# EAGLE design ADIS Arduino Breakout RevA (EAGLE 9.6.2)
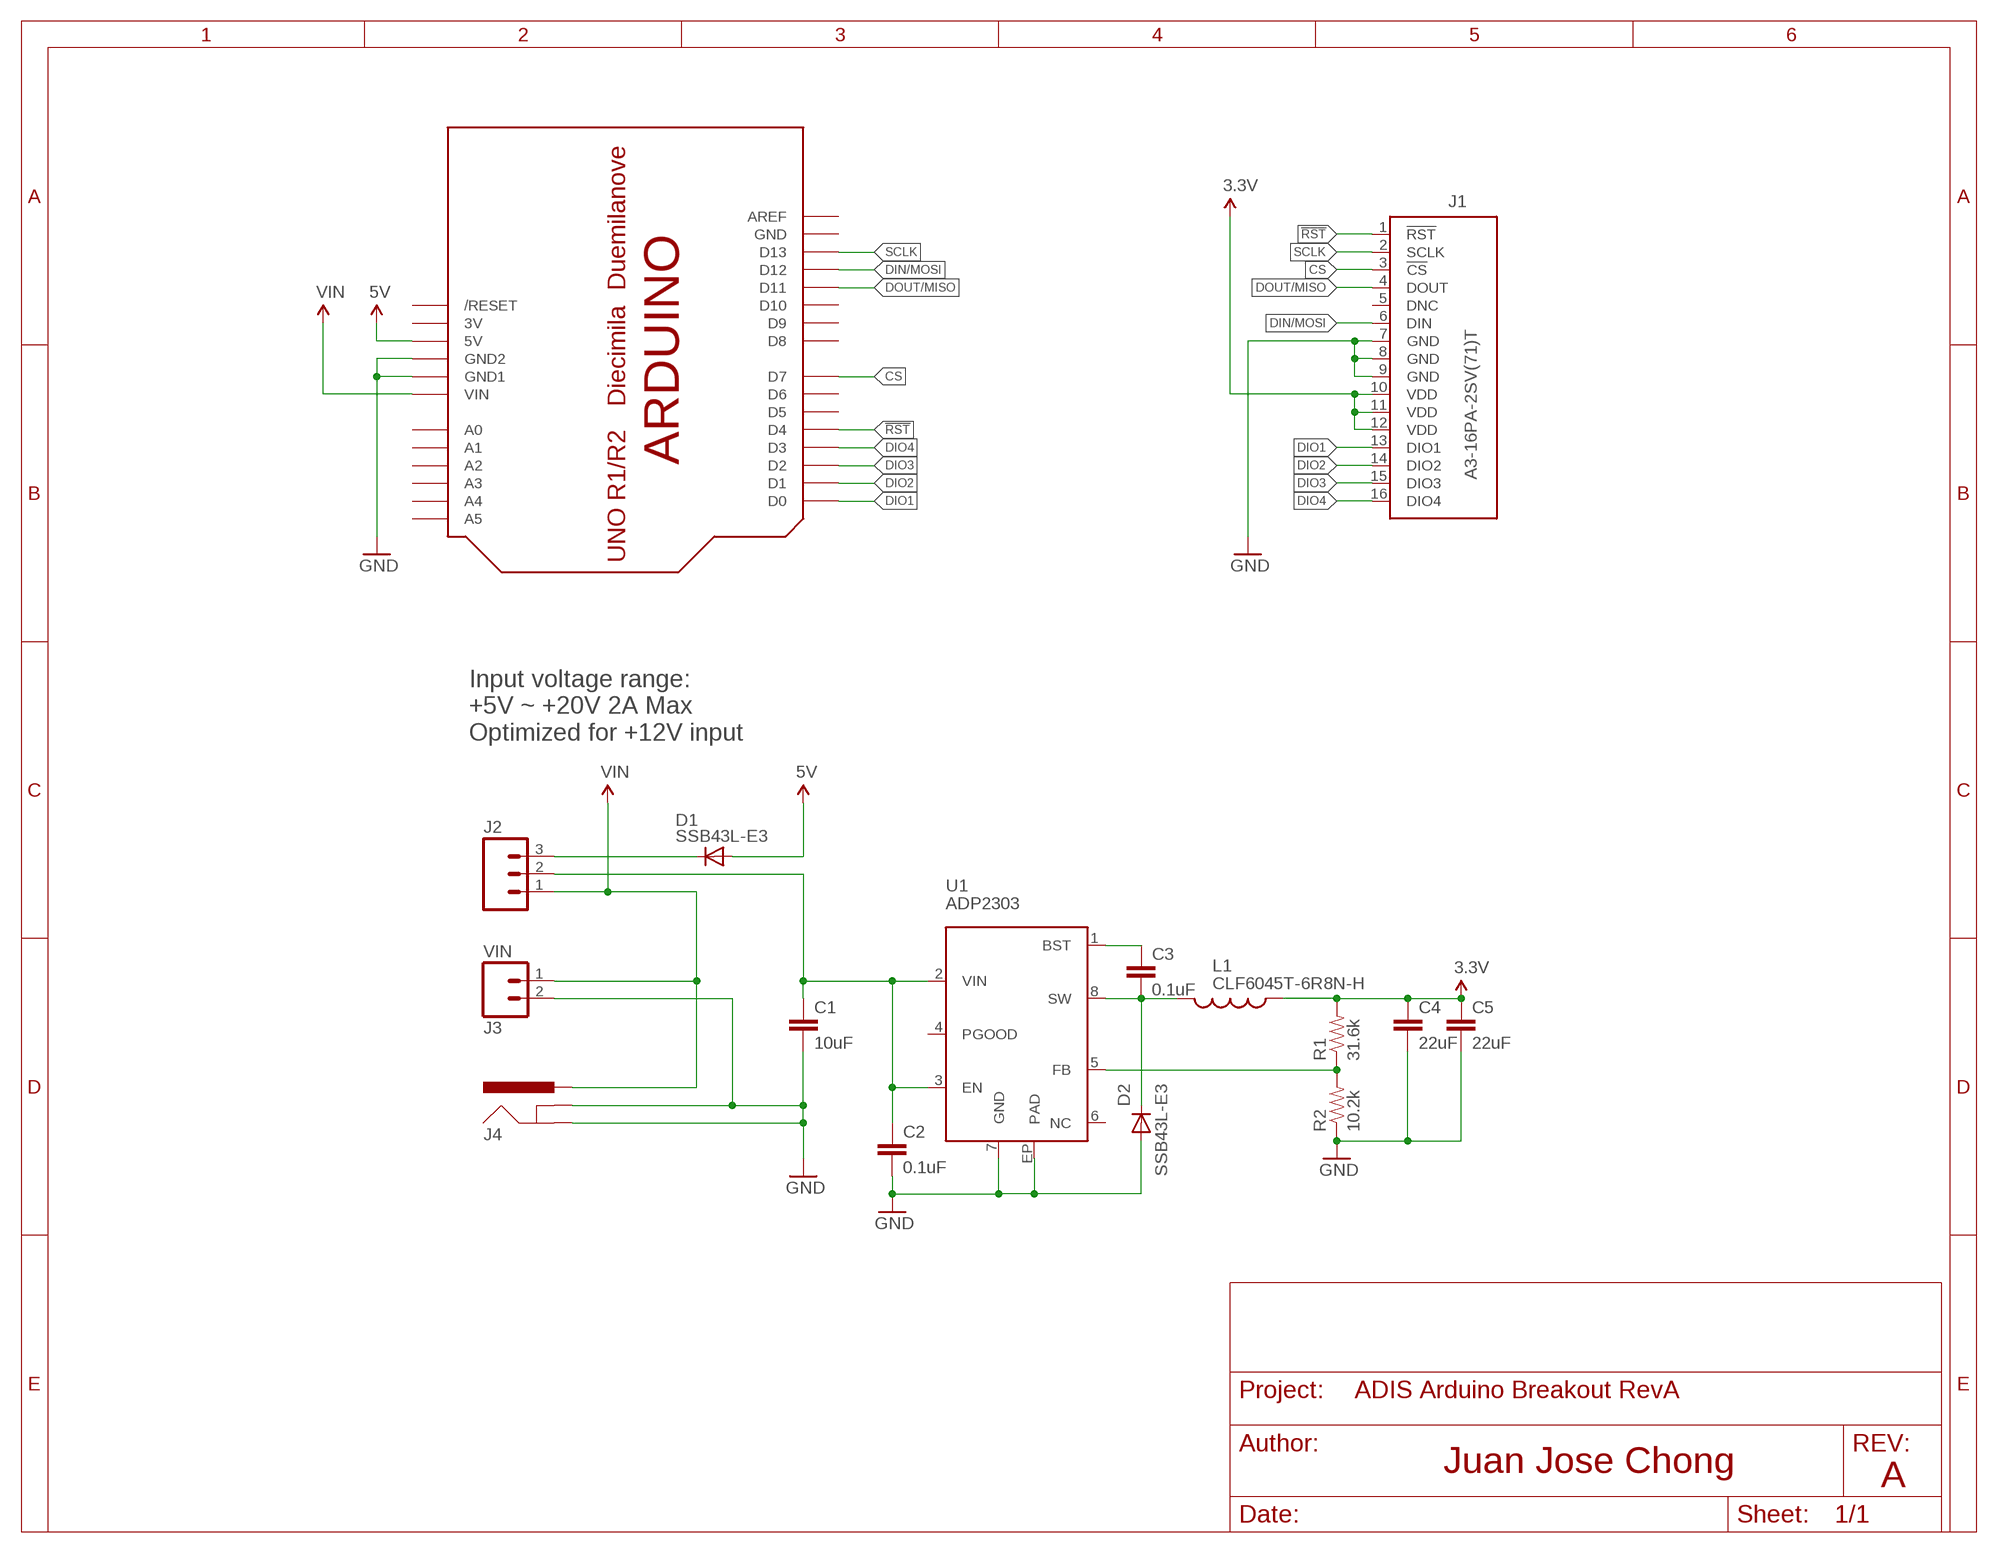
[diagram p0: schematic, sheet 1]

## Parts
C1  10uF  CAP1206  [1206]
C2  0.1uF  CAP0603-CAP  [0603-CAP]
C3  0.1uF  CAP0603-CAP  [0603-CAP]
C4  22uF  CAP1210  [1210]
C5  22uF  CAP1210  [1210]
D1  SSB43L-E3  DIODE-DO214AA  [DO214AA]
D2  SSB43L-E3  DIODE-DO214AA  [DO214AA]
J1  A3-16PA-2SV(71)T  [A3-16PA-2SV(71)-TOP]
J2  M03PTH  [1X03]
J3  VIN  M023.5MM  [SCREWTERMINAL-3.5MM-2]
J4  POWER_JACKPTH_LOCK  [POWER_JACK_PTH_LOCK]
J5  ARDUINOUNO  [ARDUINO]
L1  CLF6045T-6R8N-H  [CLF6045-H]
R1  31.6k  RESISTOR0603-RES  [0603-RES]
R2  10.2k  RESISTOR0603-RES  [0603-RES]
U1  ADP2303  [SOIC-8-PAD]

## Nets
3.3V: C4.1 C5.1 J1.10(VDD) J1.11(VDD) J1.12(VDD) L1.P$1 R1.2
5V: D1.A J5.5V
!RST: J1.1(!RST) J5.D4
CS: J1.3(!CS) J5.D7
DIN/MOSI: J1.6(DIN) J5.D12
DIO1: J1.13(DIO1) J5.D0
DIO2: J1.14(DIO2) J5.D1
DIO3: J1.15(DIO3) J5.D2
DIO4: J1.16(DIO4) J5.D3
DOUT/MISO: J1.4(DOUT) J5.D11
GND: C1.2 C2.2 C4.2 C5.2 D2.A J1.7(GND) J1.8(GND) J1.9(GND) J3.2 J4.GND J4.GNDBREAK J5.GND1 J5.GND2 R2.1 U1.7(GND) U1.EP(PAD)
N$2: R1.1 R2.2 U1.5(FB)
N$3: C3.2 D2.C L1.P$2 U1.8(SW)
N$4: C3.1 U1.1(BST)
N$6: C1.1 C2.1 J2.2 U1.2(VIN) U1.3(EN)
N$7: D1.C J2.3
SCLK: J1.2(SCLK) J5.D13
VIN: J2.1 J3.1 J4.PWR J5.VIN
Unconnected: J1.5(DNC) J5.A0 J5.A1 J5.A2 J5.A3 J5.A4 J5.A5 J5.AREF J5.D5 J5.D6 J5.D8 J5.D9 J5.D10 J5.RESET(/RESET) U1.4(PGOOD) U1.6(NC)

## Notes on the sheet
- Input voltage range:
  +5V ~ +20V 2A Max
  Optimized for +12V input
- A

## Power pins joined to a net without a drawn wire
3V: J5.3V
GND: J5.GND

## Library data of the parts
C1 = SparkFun-Passives:CAP: Capacitor Standard 0603 ceramic capacitor, and 0.1" leaded capacitor.; PARTNO: F931C106MAA
C2 C3 = SparkFun-Passives:CAP: Capacitor Standard 0603 ceramic capacitor, and 0.1" leaded capacitor.; PARTNO: CL10B104KB8NNNC
C4 C5 = SparkFun-Passives:CAP: Capacitor Standard 0603 ceramic capacitor, and 0.1" leaded capacitor.; PARTNO: GRM32ER61C226KE20L
D1 D2 = Chong:DIODE-: DIODE; PARTNO: SSB43L-E3/52T
J1 = Analog Devices iSensors:A3-16PA-2SV(71); PARTNO: A3-16PA-2SV(71)
J2 = SparkFun-Connectors:M03: Header 3 Standard 3-pin 0.1" header. Use with straight break away headers (SKU : PRT-00116), right angle break away headers (PRT-00553), swiss pins (PRT-00743), machine pins (PRT-00117), and female headers (PRT-00115). Molex polarized connector foot print use with SKU : PRT-08232 with associated crimp pins and housings.; PARTNO: PREC003SAAN-RC
J3 = SparkFun-Connectors:M02: Standard 2-pin 0.1" header. Use with - straight break away headers ( PRT-00116) - right angle break away headers (PRT-00553) - swiss pins (PRT-00743) - machine pins (PRT-00117) - female headers (PRT-00115) Molex polarized connector foot print use with: PRT-08233 with associated crimp pins and housings. 2.54_SCREWTERM for use with PRT-10571. 3.5mm Screw Terminal footprints for PRT-08084 5mm Screw Terminal footprints for use with PRT-08432; PARTNO: 20020327-C021B01LF
J4 = SparkFun-Connectors:POWER_JACK: Power Jack This is the standard 5.5mm barrel jack for power. The PTH is the most common, proven, reliable, footprint. The Slot footprint only works if the mill layer is transmitted to the PCB fab house so be warned. Mating wall wart : TOL-00298 (and others); PARTNO: PJ-002AH; PROD_ID: CONN-08197; SF_ID: PRT-00119
J5 = adafruit:ARDUINO: Arduino Diecimila/Duemilanove Make a shield with ease, this package has all the named pins as well as the two mounting drill holes and an outline of the USB and DC power connector. The outline is on the DIMENSION layer, so if your board house uses it they will cut the outline to match. http://www.ladyada.net/library/pcb/eaglelibrary.html
L1 = AnalogDevices:CLF6045T-6R8N-H; PARTNO: CLF6045T-6R8N-H
R1 = SparkFun-Passives:RESISTOR: Resistor Basic schematic elements and footprints for 0603, 1206, and PTH resistors.; PARTNO: ERJ-3EKF3162V
R2 = SparkFun-Passives:RESISTOR: Resistor Basic schematic elements and footprints for 0603, 1206, and PTH resistors.; PARTNO: ERJ-3EKF1022V
U1 = AnalogDevices:ADP2303; PARTNO: ADP2303ARDZ

## Board
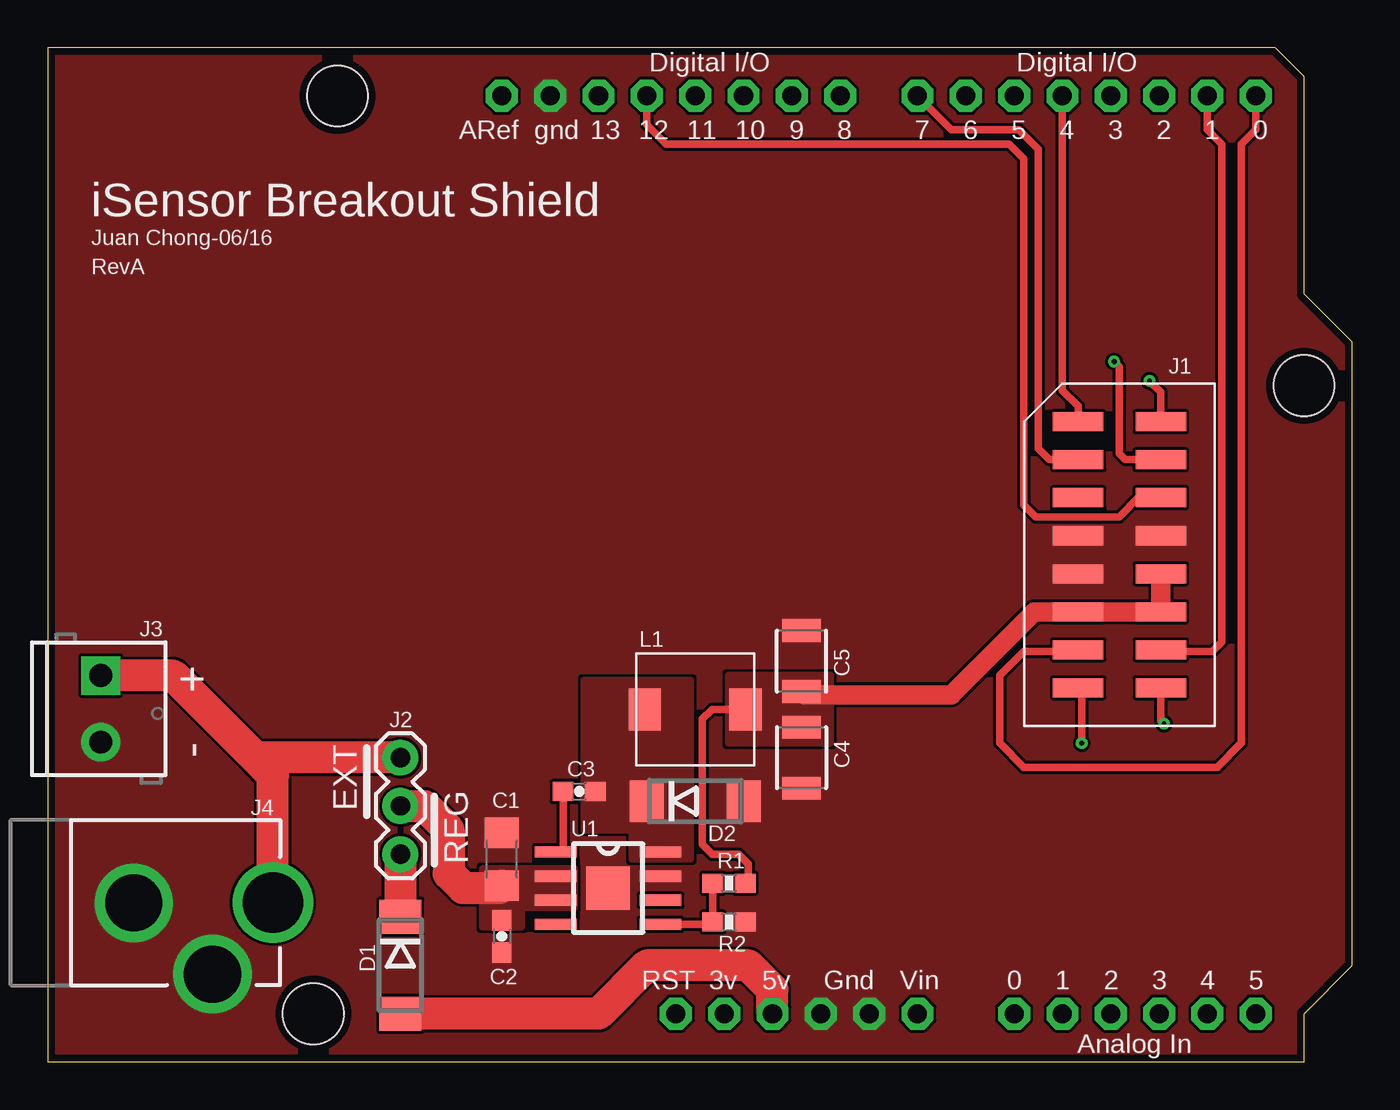
[diagram p1: board, top side]
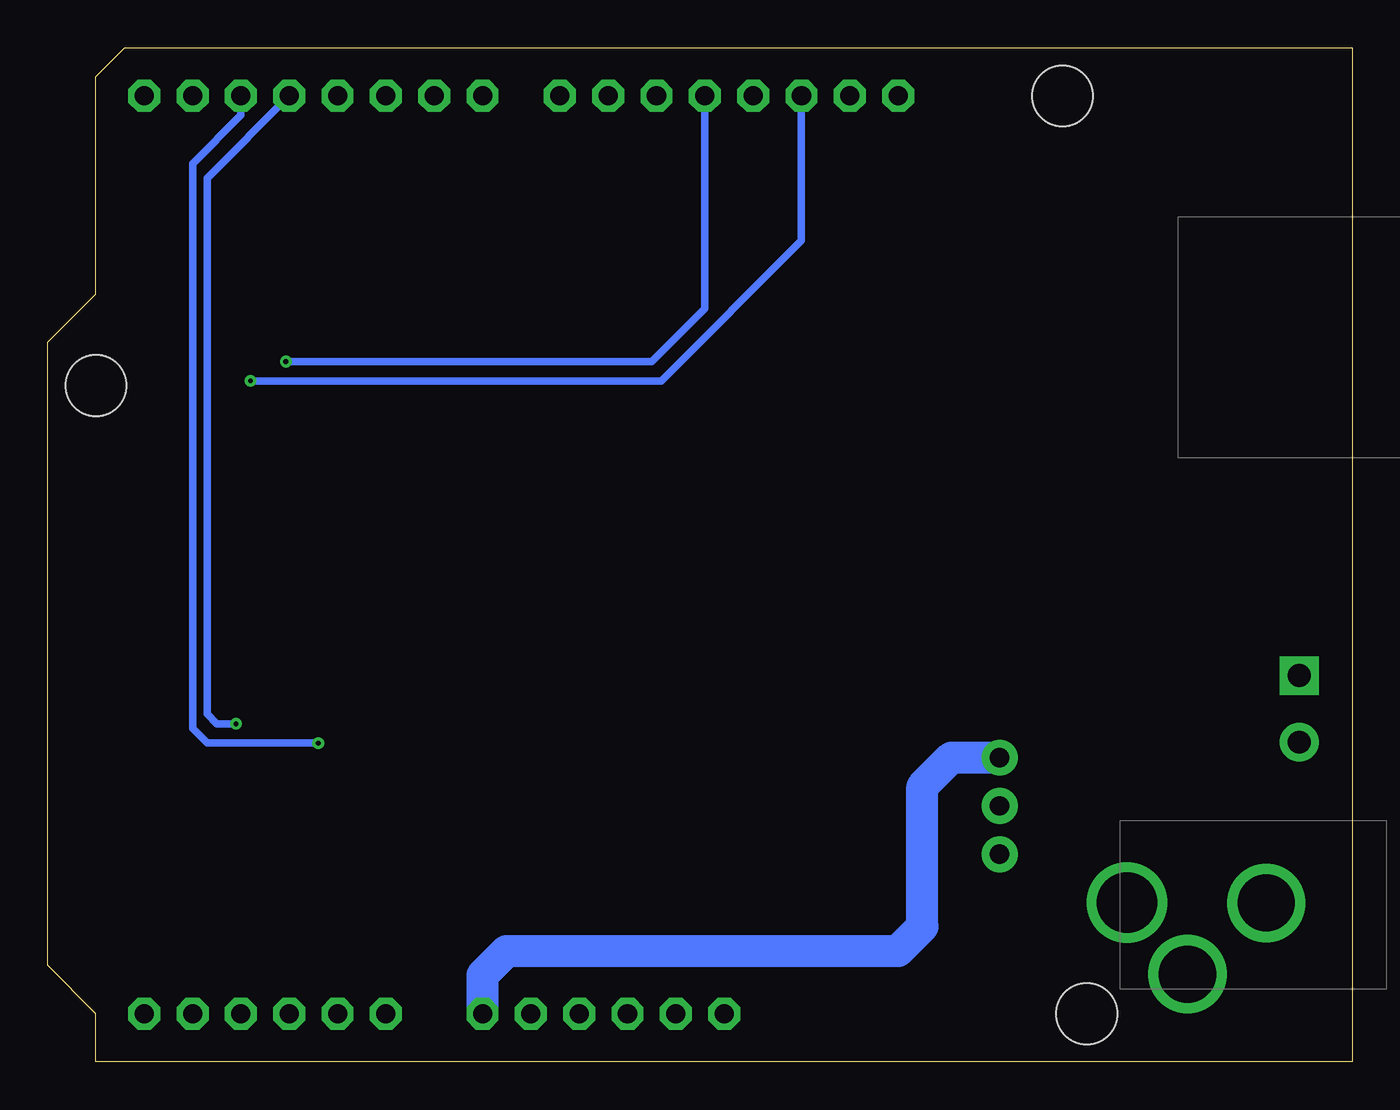
[diagram p2: board, bottom side, seen from below]

Size 68.58 x 53.34 mm. Coordinates in mm from the lower left corner, seen from the top.
Copper layers (1*16): Top 0.0356mm / dielectric 1.5011mm / Bottom 0.0356mm
Design rules "LaenPCBOrder": minimum track width 6mil, minimum drill 13mil, track to track 6mil, track to pad 6mil, pad to pad 6mil, via to via 6mil, smd to smd 6mil, copper to edge 15mil, drill to drill 6mil, minimum pad ring 7mil, minimum via ring 7mil, stop-mask expansion 4mil, vias tented up to drill 0mil, thermal gap 10mil

### Footprints (pad centres in the part's own frame; a part is rotated, then mirrored left to right if it is on the bottom)
1206 = smd 1.6 x 1.8: 1 -1.4,0; 2 1.4,0
0603-CAP = smd 1.1 x 1: 1 -0.85,0; 2 0.85,0
1210 = smd 1.2 x 2: 1 -1.6,0; 2 1.6,0
DO214AA = smd 1.8 x 2.2: A 2.55,0; C -2.55,0
A3-16PA-2SV(71)-TOP = smd 1 x 2.65: 1 -7,-2.225; 2 -7,2.125; 3 -5,-2.225; 4 -5,2.125; 5 -3,-2.225; 6 -3,2.125; 7 -1,-2.225; 8 -1,2.125; 9 1,-2.225; 10 1,2.125; 11 3,-2.225; 12 3,2.125; 13 5,-2.225; 14 5,2.125; 15 7,-2.225; 16 7,2.125
1X03 = drill 1.016 pad 1.88: 1 0,0; 2 2.54,0; 3 5.08,0
SCREWTERMINAL-3.5MM-2 = drill 1.2 pad 2.032 square: 1 0,0 | drill 1.2 pad 2.032: 2 3.5,0
POWER_JACK_PTH_LOCK = drill 2.997 pad 4.115: GND 0.025,6.557; GNDBREAK 3.762,10.7 | drill 3.2 pad 4.115: PWR 0,13.878
ARDUINO = drill 1 pad 1.676 octagon: 3V 35.56,2.54; 5V 38.1,2.54; A0 50.8,2.54; A1 53.34,2.54; A2 55.88,2.54; A3 58.42,2.54; A4 60.96,2.54; A5 63.5,2.54; AREF 23.876,50.8; D0 63.5,50.8; D1 60.96,50.8; D2 58.42,50.8; D3 55.88,50.8; D4 53.34,50.8; D5 50.8,50.8; D6 48.26,50.8; D7 45.72,50.8; D8 41.656,50.8; D9 39.116,50.8; D10 36.576,50.8; D11 34.036,50.8; D12 31.496,50.8; D13 28.956,50.8; GND 26.416,50.8; GND1 43.18,2.54; GND2 40.64,2.54; RESET 33.02,2.54; VIN 45.72,2.54 | hole 3.2: 15.24,50.8; 66.04,35.56; 13.97,2.54
CLF6045-H = smd 1.7 x 2.2: P$1 -2.65,0; P$2 2.65,0
0603-RES = smd 1.1 x 1: 1 -0.85,0; 2 0.85,0
SOIC-8-PAD = smd 0.6 x 2.2: 1 -1.905,-2.75; 2 -0.635,-2.75; 3 0.635,-2.75; 4 1.905,-2.75; 5 1.905,2.75; 6 0.635,2.75; 7 -0.635,2.75; 8 -1.905,2.75 | smd 2.29 x 2.29: EP 0,0

### Placement (x,y rotation side)
C1  23.88,10.67 90 top
C2  23.88,6.6 270 top
C3  27.94,14.22 0 top
C4  39.62,16 270 top
C5  39.62,21.08 90 top
D1  18.54,5.08 270 top
D2  34.04,13.72 0 top
J1  56.39,26.67 270 top
J2  18.54,16 270 top
J3  2.79,20.32 270 top
J4  -2.03,8.38 270 top
J5  0,0 0 top
L1  34.04,18.54 180 top
R1  35.81,9.4 0 top
R2  35.81,7.37 180 top
U1  29.46,9.14 270 top

### Tracks (layer width: path | path; a pad name or v marks a point on that pad's centre or on a via)
3.3V
  Top 0.406: L1.P$1 34.92,18.54 34.42,18.03 34.42,11.43 34.92,10.92 36.32,10.92 36.83,10.41 36.83,9.56 R1.2
  Top 1.016: J1.10 J1.12 J1.11 51.86,23.67 47.5,19.3 39.8,19.3 C5.1
  pour Top (no thermals): 41.15,20.32 35.81,20.32 35.81,16.76 41.15,16.76
5V
  Top 1.676: J5.5V 38.1,3.81 36.83,5.08 31.5,5.08 28.96,2.54 18.55,2.54 D1.A
!RST
  Top 0.406: J5.D4 53.34,35.31 54.16,34.48 J1.1
CS
  Top 0.406: J1.3 52.66,31.67 52.07,32.26 52.07,48.01 51.05,49.02 47.5,49.02 J5.D7
DIN/MOSI
  Top 0.406: J1.6 57.38,29.72 56.31,28.65 51.94,28.65 51.31,29.29 51.31,47.5 50.55,48.26 32.51,48.26 31.5,49.28 J5.D12
DIO1
  Top 0.406: J5.D0 63.5,49.02 62.74,48.26 62.74,16.76 61.47,15.49 51.31,15.49 50.04,16.76 50.04,20.32 51.31,21.59 54.08,21.59 J1.13
DIO2
  Top 0.406: J5.D1 60.96,49.02 61.72,48.26 61.72,22.1 61.21,21.59 58.59,21.59 J1.14
DIO3  (via drill 0.25)
  Top 0.406: v54.36,16.76 54.36,19.48 J1.15
  Bottom 0.406: v54.36,16.76 60.2,16.76 60.96,17.53 60.96,47.24 58.42,49.78 J5.D2
DIO4  (via drill 0.25)
  Top 0.406: J1.16 58.51,17.94 v58.67,17.78
  Bottom 0.406: v58.67,17.78 59.69,17.78 60.2,18.29 60.2,46.48 J5.D3
DOUT/MISO  (via drill 0.25)
  Top 0.406: J1.4 56.65,31.67 56.31,32 56.31,36.58 v56.06,36.83
  Bottom 0.406: v56.06,36.83 36.83,36.83 34.04,39.62 J5.D11
GND
  pour Top (rank 6, no thermals): 0,53.34 68.58,53.34 68.58,0 0,0
N$2
  Top 0.406: U1.5 34.84,7.24 R2.2 R1.1
N$3
  pour Top (no thermals): 28.19,20.07 28.19,12.19 30.73,12.19 30.73,10.67 33.78,10.67 33.78,20.07
N$4
  Top 0.406: U1.1 27.09,11.05 C3.1
N$6
  Top 1.676: J2.2 19.81,13.46 21.08,12.19 21.08,9.91 21.84,9.14 23.75,9.14 C1.1
  pour Top (no thermals): 27.69,10.16 22.86,10.16 22.86,7.11 24.89,7.11 24.89,8.13 27.69,8.13
N$7
  Top 1.676: J2.3 D1.C
SCLK  (via drill 0.25)
  Top 0.406: J1.2 58.51,35.21 v57.91,35.81
  Bottom 0.406: v57.91,35.81 36.32,35.81 28.96,43.18 J5.D13
VIN
  Top 1.676: J2.1 10.92,16 | 10.92,16 6.6,20.32 J3.1 | J4.PWR 11.85,15.08 10.92,16
  Bottom 1.676: J5.VIN 45.72,4.57 44.45,5.84 23.88,5.84 22.61,7.11 22.61,14.48 21.08,16 J2.1

### Text on the board
tNames: iSensor Breakout Shield | Juan Chong-06/16 | RevA | + | - | EXT | REG